# Altium schematic sheet Steering Wheel Carrier Board Mezzanine.SchDoc: Steering Wheel Interface - Mezzanine
size B; Organization: Midnight Sun Solar Rayce Car Team; Address1: University of Waterloo; Address2: 200 University Ave W; Address3: Waterloo, ON, Canada; Address4: N2L 3E9; DocumentNumber: 1; SheetNumber: 1; SheetTotal: 3; Website: www.uwmidsun.com; ProjectName: ProjectName
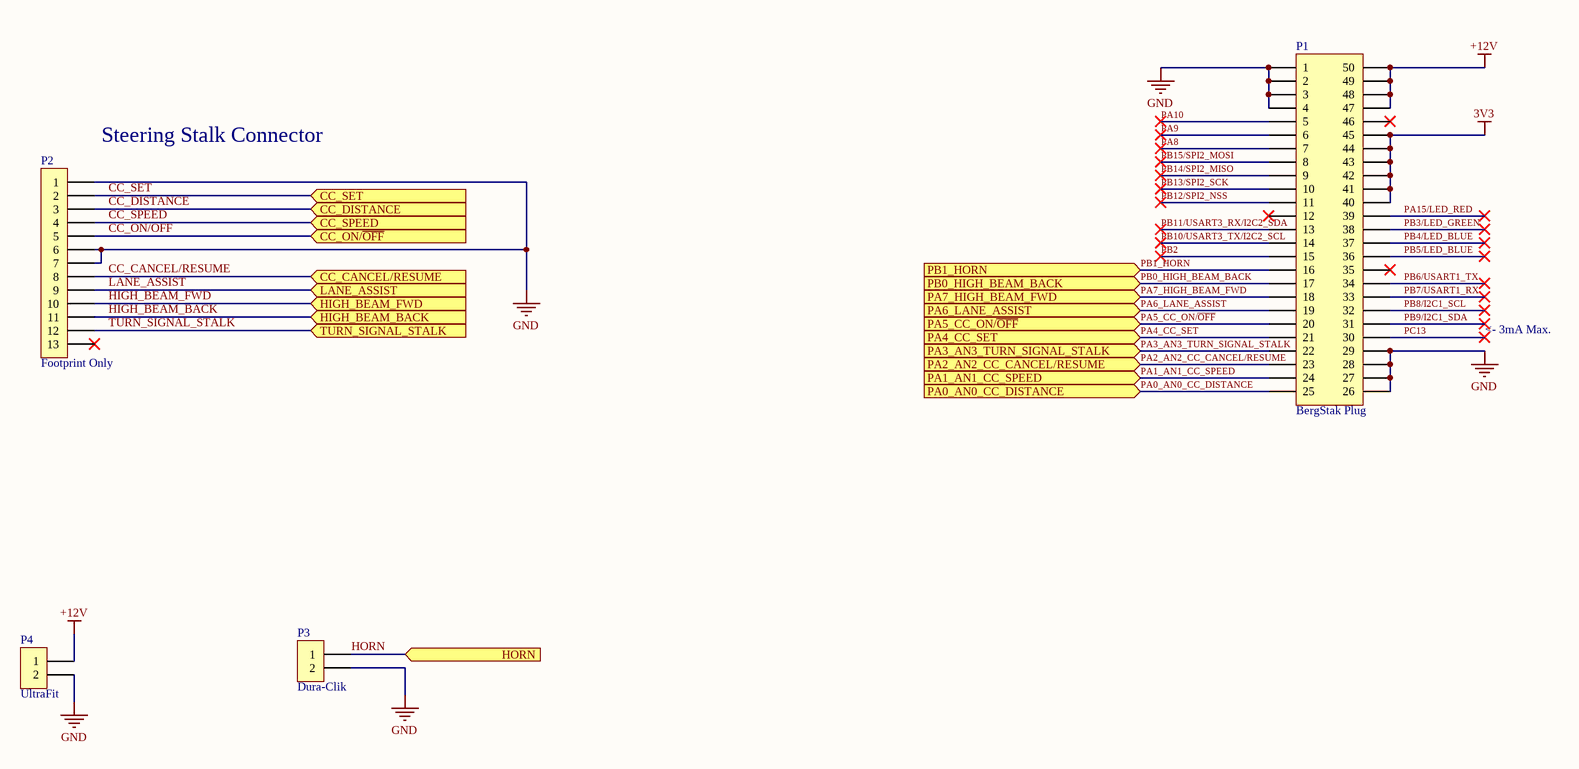
[diagram p0: Steering Wheel Carrier Board Mezzanine.SchDoc]

## Parts
P1  Series: BergStak Plug  [CONN, Bergstak 50 Pos Plug]  (hidden comment: CONN 50POS Bergstak Plug 0.02")
P2  Footprint Only  [CONN 13POS CARD EDGE]  (no BOM)
P3  Dura-Clik  [CONN, 2POS Dura-Click Vertical]
P4  Series: UltraFit  [CONN, 2POS ULTRA-FIT]  (hidden comment: CONN 2POS ULTRA-FIT 0.138")

## Ports
CC_CANCEL/RESUME (in), CC_DISTANCE (in), CC_ON/~{OFF} (in), CC_SET (in), CC_SPEED (in), HIGH_BEAM_BACK (in), HIGH_BEAM_FWD (in), HORN (in), LANE_ASSIST (in), PA0_AN0_CC_DISTANCE (in), PA1_AN1_CC_SPEED (in), PA2_AN2_CC_CANCEL/RESUME (in), PA3_AN3_TURN_SIGNAL_STALK (in), PA4_CC_SET (in), PA5_CC_ON/~{OFF} (in), PA6_LANE_ASSIST (in), PA7_HIGH_BEAM_FWD (in), PB0_HIGH_BEAM_BACK (in), PB1_HORN (in), TURN_SIGNAL_STALK (in)

## Nets
3V3: P1.40 P1.41 P1.42 P1.43 P1.44 P1.45
+12V: P1.47 P1.48 P1.49 P1.50 P4.1
GND: P1.1 P1.2 P1.3 P1.4 P1.26 P1.27 P1.28 P1.29 P2.1 P2.6 P2.7 P3.2 P4.2
CC_CANCEL/RESUME: P2.8 ; port CC_CANCEL/RESUME
CC_DISTANCE: P2.3 ; port CC_DISTANCE
CC_ON/~{OFF}: P2.5 ; port CC_ON/~{OFF}
CC_SET: P2.2 ; port CC_SET
CC_SPEED: P2.4 ; port CC_SPEED
HIGH_BEAM_BACK: P2.11 ; port HIGH_BEAM_BACK
HIGH_BEAM_FWD: P2.10 ; port HIGH_BEAM_FWD
HORN: P3.1 ; port HORN
LANE_ASSIST: P2.9 ; port LANE_ASSIST
PA0_AN0_CC_DISTANCE: P1.25 ; port PA0_AN0_CC_DISTANCE
PA1_AN1_CC_SPEED: P1.24 ; port PA1_AN1_CC_SPEED
PA2_AN2_CC_CANCEL/RESUME: P1.23 ; port PA2_AN2_CC_CANCEL/RESUME
PA3_AN3_TURN_SIGNAL_STALK: P1.22 ; port PA3_AN3_TURN_SIGNAL_STALK
PA4_CC_SET: P1.21 ; port PA4_CC_SET
PA5_CC_ON/~{OFF}: P1.20 ; port PA5_CC_ON/~{OFF}
PA6_LANE_ASSIST: P1.19 ; port PA6_LANE_ASSIST
PA7_HIGH_BEAM_FWD: P1.18 ; port PA7_HIGH_BEAM_FWD
PA8: P1.7
PA9: P1.6
PA10: P1.5
PA15/LED_RED: P1.39
PB0_HIGH_BEAM_BACK: P1.17 ; port PB0_HIGH_BEAM_BACK
PB1_HORN: P1.16 ; port PB1_HORN
PB2: P1.15
PB3/LED_GREEN: P1.38
PB4/LED_BLUE: P1.37
PB5/LED_BLUE: P1.36
PB6/USART1_TX: P1.34
PB7/USART1_RX: P1.33
PB8/I2C1_SCL: P1.32
PB9/I2C1_SDA: P1.31
PB10/USART3_TX/I2C2_SCL: P1.14
PB11/USART3_RX/I2C2_SDA: P1.13
PB12/SPI2_NSS: P1.11
PB13/SPI2_SCK: P1.10
PB14/SPI2_MISO: P1.9
PB15/SPI2_MOSI: P1.8
PC13: P1.30
TURN_SIGNAL_STALK: P2.12 ; port TURN_SIGNAL_STALK

Not connected (* = marked no-connect by the designer): P1 12* 35* 46*; P2 13*

## Notes on the sheet
- (near P2) Steering Stalk Connector
- <- 3mA Max.
- PROJECT
- DOCUMENT
- DRAWN BY
- LAST MODIFIED
- PART NUMBER
- REVISION
- SHEET
- VARIANT
- OF
- Engineering 5 - 1002
  University of Waterloo
  (519) 888-4567 x32978
  hardware@uwmidsun.com

## Library data of the parts
P1 = CONN 50POS Bergstak Plug 0.02": 50 Position Connector Plug, Outer Shroud Contacts Surface Mount Gold; Manufacturer 1: Amphenol FCI; Manufacturer Part Number 1: 10132797-055100LF; Number of Positions: 50; Mated Stacking Heights: 5mm; Pitch: 0.020" (0.50mm); Supplier 1: Digi-Key; Supplier Part Number 1: 609-5226-1-ND; Packaging: Cut Tape (CT); Part Status: Active; Connector Type: Plug, Outer Shroud Contacts; Number of Rows: 2; Mounting Type: Surface Mount; Contact Finish: Gold; Contact Finish Thickness: 1µin (0.025µm); Height Above Board: 0.169" (4.30mm); ComponentLink1URL: http://portal.fciconnect.com/Comergent//fci/drawing/10132797.pdf; ComponentLink1Description: http://portal.fciconnect.com/Comergent//fci/drawing/10132797.pdf
P2 = CONN 13POS 0.1" CARD EDGE
P3 = CONN 2POS DURA-CLIK 0.079" VERT: 2 Positions Header, Shrouded Connector 0.079" (2.00mm) Surface Mount, Vertical Tin; Manufacturer: Molex, LLC; Manufacturer Part Number: 5600200220; Style: Board to Cable/Wire; Shrouding: Shrouded - 4 Wall; Number of Positions: 2; Number of Positions Loaded: All; Mated Stacking Heights: 9.3mm; Supplier 1: Digi-Key; RoHS: RoHS Compliant; Category: Connectors, Interconnects; Stock 1: 11912; Pricing 1: 1=1.16, 10=1.012, 25=0.952, 50=0.9122, 100=0.8727, 250=0.79336 (CAD); Packaging: Cut Tape (CT); Part Status: Active; Connector Type: Header; Contact Type: Male Pin; Pitch - Mating: 0.079" (2.00mm); Number of Rows: 1; Row Spacing - Mating: -; Mounting Type: Surface Mount; Termination: Solder; Fastening Type: Latch Lock; Contact Length - Mating: -; Contact Length - Post: -; Overall Contact Length: -; Insulation Height: 0.315" (8.00mm); Contact Shape: Square; Contact Finish - Mating: Tin; Contact Finish Thickness - Mating: -; Contact Finish - Post: Tin; Contact Material: Copper Alloy; Insulation Material: Polyamide (PA), Nylon; Features: Solder Retention; Operating Temperature: -; Ingress Protection: -; Material Flammability Rating: -; Insulation Color: Natural; Current Rating: -; Voltage Rating: -; Contact Finish Thickness - Post: -; Applications: Automotive, Industrial; ComponentLink1URL: http://www.molex.com/pdm_docs/sd/5600200220_sd.pdf; ComponentLink1Description: http://www.molex.com/pdm_docs/sd/5600200220_sd.pdf; Supplier Part Number 1: WM10862CT-ND
P4 = CONN 2POS ULTRA-FIT 0.138": 2 Positions Header, Shrouded Connector 0.138" (3.50mm) Through Hole Gold; Manufacturer 1: Molex, LLC; Manufacturer Part Number 1: 1722861302; Style: Board to Board or Cable; Shrouding: Shrouded - 4 Wall; Number of Positions: 2; Number of Positions Loaded: All; Contact Length - Post: 0.126" (3.20mm); Material Flammability Rating: UL94 V-0; Mated Stacking Heights: 26.99mm; Voltage: 400V; Supplier 1: Digi-Key; Supplier Part Number 1: WM11673-ND; Packaging: Tray; Part Status: Active; Connector Type: Header; Contact Type: Male Pin; Pitch - Mating: 0.138" (3.50mm); Number of Rows: 1; Row Spacing - Mating: -; Mounting Type: Through Hole; Termination: Kinked Pin, Solder; Fastening Type: Latch Holder; Contact Length - Mating: -; Overall Contact Length: -; Insulation Height: 0.465" (11.80mm); Contact Shape: Square; Contact Finish - Mating: Gold; Contact Finish Thickness - Mating: 30µin (0.76µm); Contact Finish - Post: Tin; Contact Material: Copper Alloy; Insulation Material: Liquid Crystal Polymer (LCP); Operating Temperature: -40°C ~ 120°C; Ingress Protection: -; Insulation Color: Black; Current Rating: -; Contact Finish Thickness - Post: 60µin (1.52µm); ComponentLink1URL: http://www.molex.com/pdm_docs/sd/1722861302_sd.pdf; ComponentLink1Description: http://www.molex.com/pdm_docs/sd/1722861302_sd.pdf